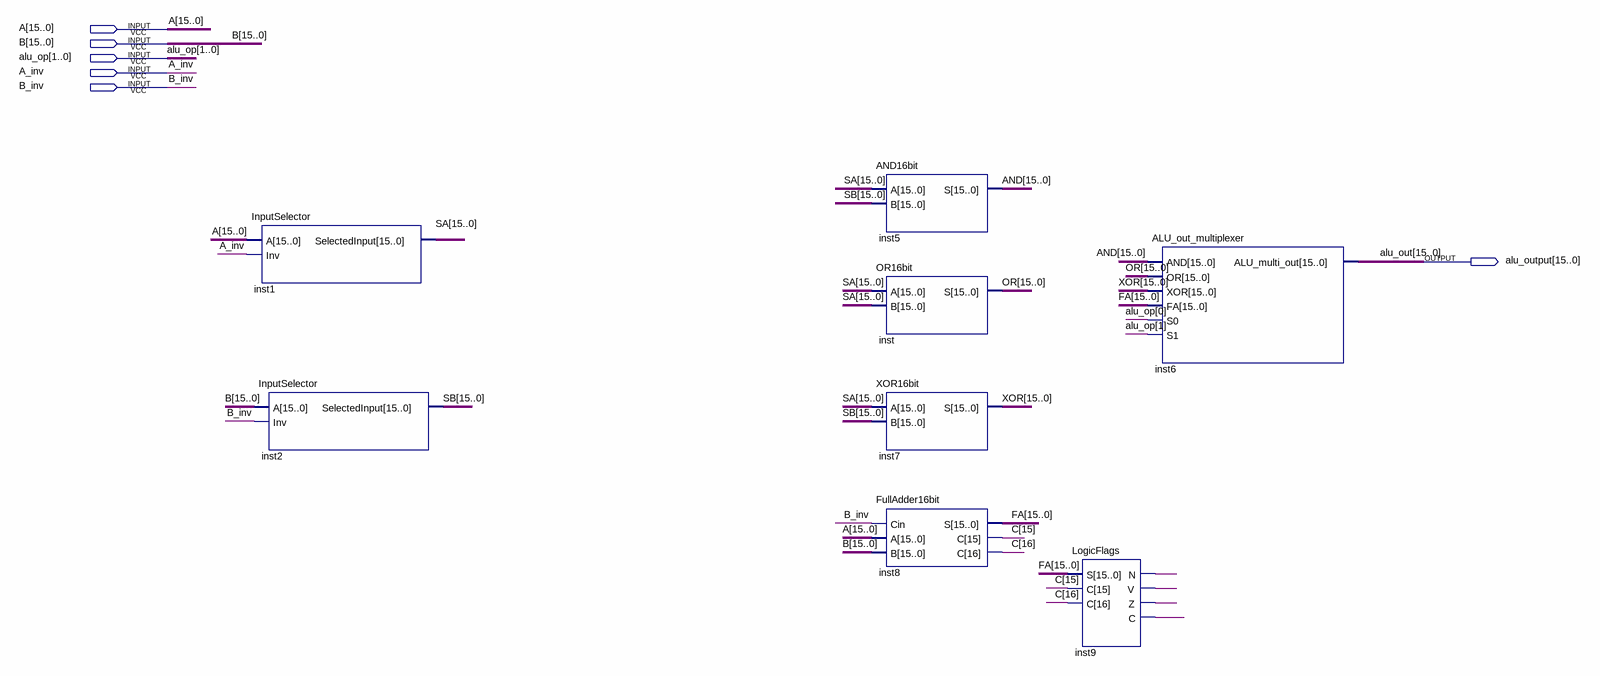
[diagram p0: schematic sheet]
// Quartus schematic MainProject.bdf as structural Verilog: 8 symbols, 6 pins
module MainProject (
  input  [15:0] A,
  input  [15:0] B,
  input  [1:0] alu_op,
  input  A_inv,
  input  B_inv,
  output [15:0] alu_output
);

  wire inst9_c, inst9_n, inst9_v, inst9_z;
  wire [15:0] AND, FA, OR, SA, SB, XOR;
  wire [16:15] C;

  InputSelector inst1 (.A(A), .Inv(A_inv), .SelectedInput(SA));
  InputSelector inst2 (.A(B), .Inv(B_inv), .SelectedInput(SB));
  AND16bit inst5 (.A(SA), .B(SB), .S(AND));
  OR16bit inst (.A(SA), .B(SA), .S(OR));
  XOR16bit inst7 (.A(SA), .B(SB), .S(XOR));
  FullAdder16bit inst8 (.Cin(B_inv), .A(A), .B(B), .S(FA), .C(C));
  LogicFlags inst9 (.S(FA), .C({C, inst9_c}), .N(inst9_n), .V(inst9_v), .Z(inst9_z));
  ALU_out_multiplexer inst6 (
    .AND(AND), .OR(OR), .XOR(XOR), .FA(FA), .S0(alu_op[0]), .S1(alu_op[1]), .ALU_multi_out(alu_output));

  // Other names for the same wires on the sheet: alu_out[15:0] = alu_output
endmodule
